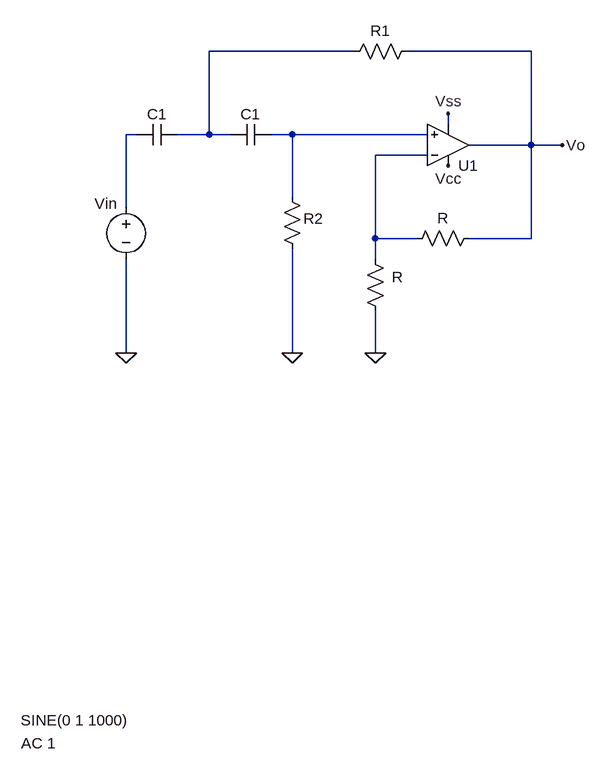
[diagram p0: schematic Draft1.asc]
Draft1.asc, the LTspice schematic file:
Version 4
SHEET 1 880 988
WIRE 96 -96 -128 -96
WIRE 368 -96 176 -96
WIRE 240 16 240 0
WIRE -240 32 -256 32
WIRE -128 32 -128 -96
WIRE -128 32 -176 32
WIRE -96 32 -128 32
WIRE 0 32 -32 32
WIRE 208 32 0 32
WIRE 368 48 368 -96
WIRE 368 48 272 48
WIRE 416 48 368 48
WIRE 208 64 128 64
WIRE 0 128 0 32
WIRE -256 144 -256 32
WIRE 128 192 128 64
WIRE 192 192 128 192
WIRE 368 192 368 48
WIRE 368 192 272 192
WIRE 128 224 128 192
WIRE -256 368 -256 224
WIRE 0 368 0 208
WIRE 128 368 128 304
FLAG 240 0 Vss
FLAG 240 80 Vcc
FLAG -256 368 0
FLAG 0 368 0
FLAG 128 368 0
FLAG 416 48 Vo
SYMBOL voltage -256 128 R0
WINDOW 123 -161 841 Left 2
WINDOW 39 0 0 Left 0
WINDOW 3 -162 806 Left 2
WINDOW 0 -48 10 Left 2
SYMATTR Value2 AC 1
SYMATTR Value SINE(0 1 1000)
SYMATTR InstName Vin
SYMBOL cap -32 16 R90
WINDOW 0 0 32 VBottom 2
WINDOW 3 32 32 VTop 2
SYMATTR InstName C1
SYMATTR Value ""
SYMBOL res 16 224 R180
WINDOW 0 -32 63 Left 2
WINDOW 3 36 19 Left 2
SYMATTR InstName R2
SYMATTR Value ""
SYMBOL res 288 176 R90
WINDOW 0 0 56 VBottom 2
WINDOW 3 32 56 VTop 2
SYMATTR InstName R
SYMATTR Value ""
SYMBOL res 144 320 R180
WINDOW 0 -27 69 Left 2
WINDOW 3 36 40 Left 2
SYMATTR InstName R
SYMATTR Value ""
SYMBOL OpAmps\\opamp2 240 112 M180
SYMATTR InstName U1
SYMATTR Value ""
SYMBOL cap -176 16 R90
WINDOW 0 0 32 VBottom 2
WINDOW 3 32 32 VTop 2
SYMATTR InstName C1
SYMATTR Value ""
SYMBOL res 192 -112 R90
WINDOW 0 0 56 VBottom 2
WINDOW 3 32 56 VTop 2
SYMATTR InstName R1
SYMATTR Value ""

The netlist it stands for:
* Draft1.asc
Vin N002 0 SINE(0 1 1000) AC 1
C1 N003 N001
R2 0 N003
R Vo N004
R 0 N004
XU1 N003 N004 Vcc Vss Vo opamp2  ; pins In+ In- V+ V- OUT
C1 N001 N002
R1 Vo N001
.backanno
.end